# EasyEDA Pro project PCB文件.epro

# Schematic Schematic1
Board Name: Board1; Create Date: 2025-10-16; Page Name: P1; Project Name: 云端一体环境监测系统; Schematic Name: Schematic1; Update Date: 2025-11-07; Company: 嘉立创EDA; Page Size: A4; Version: V1.0
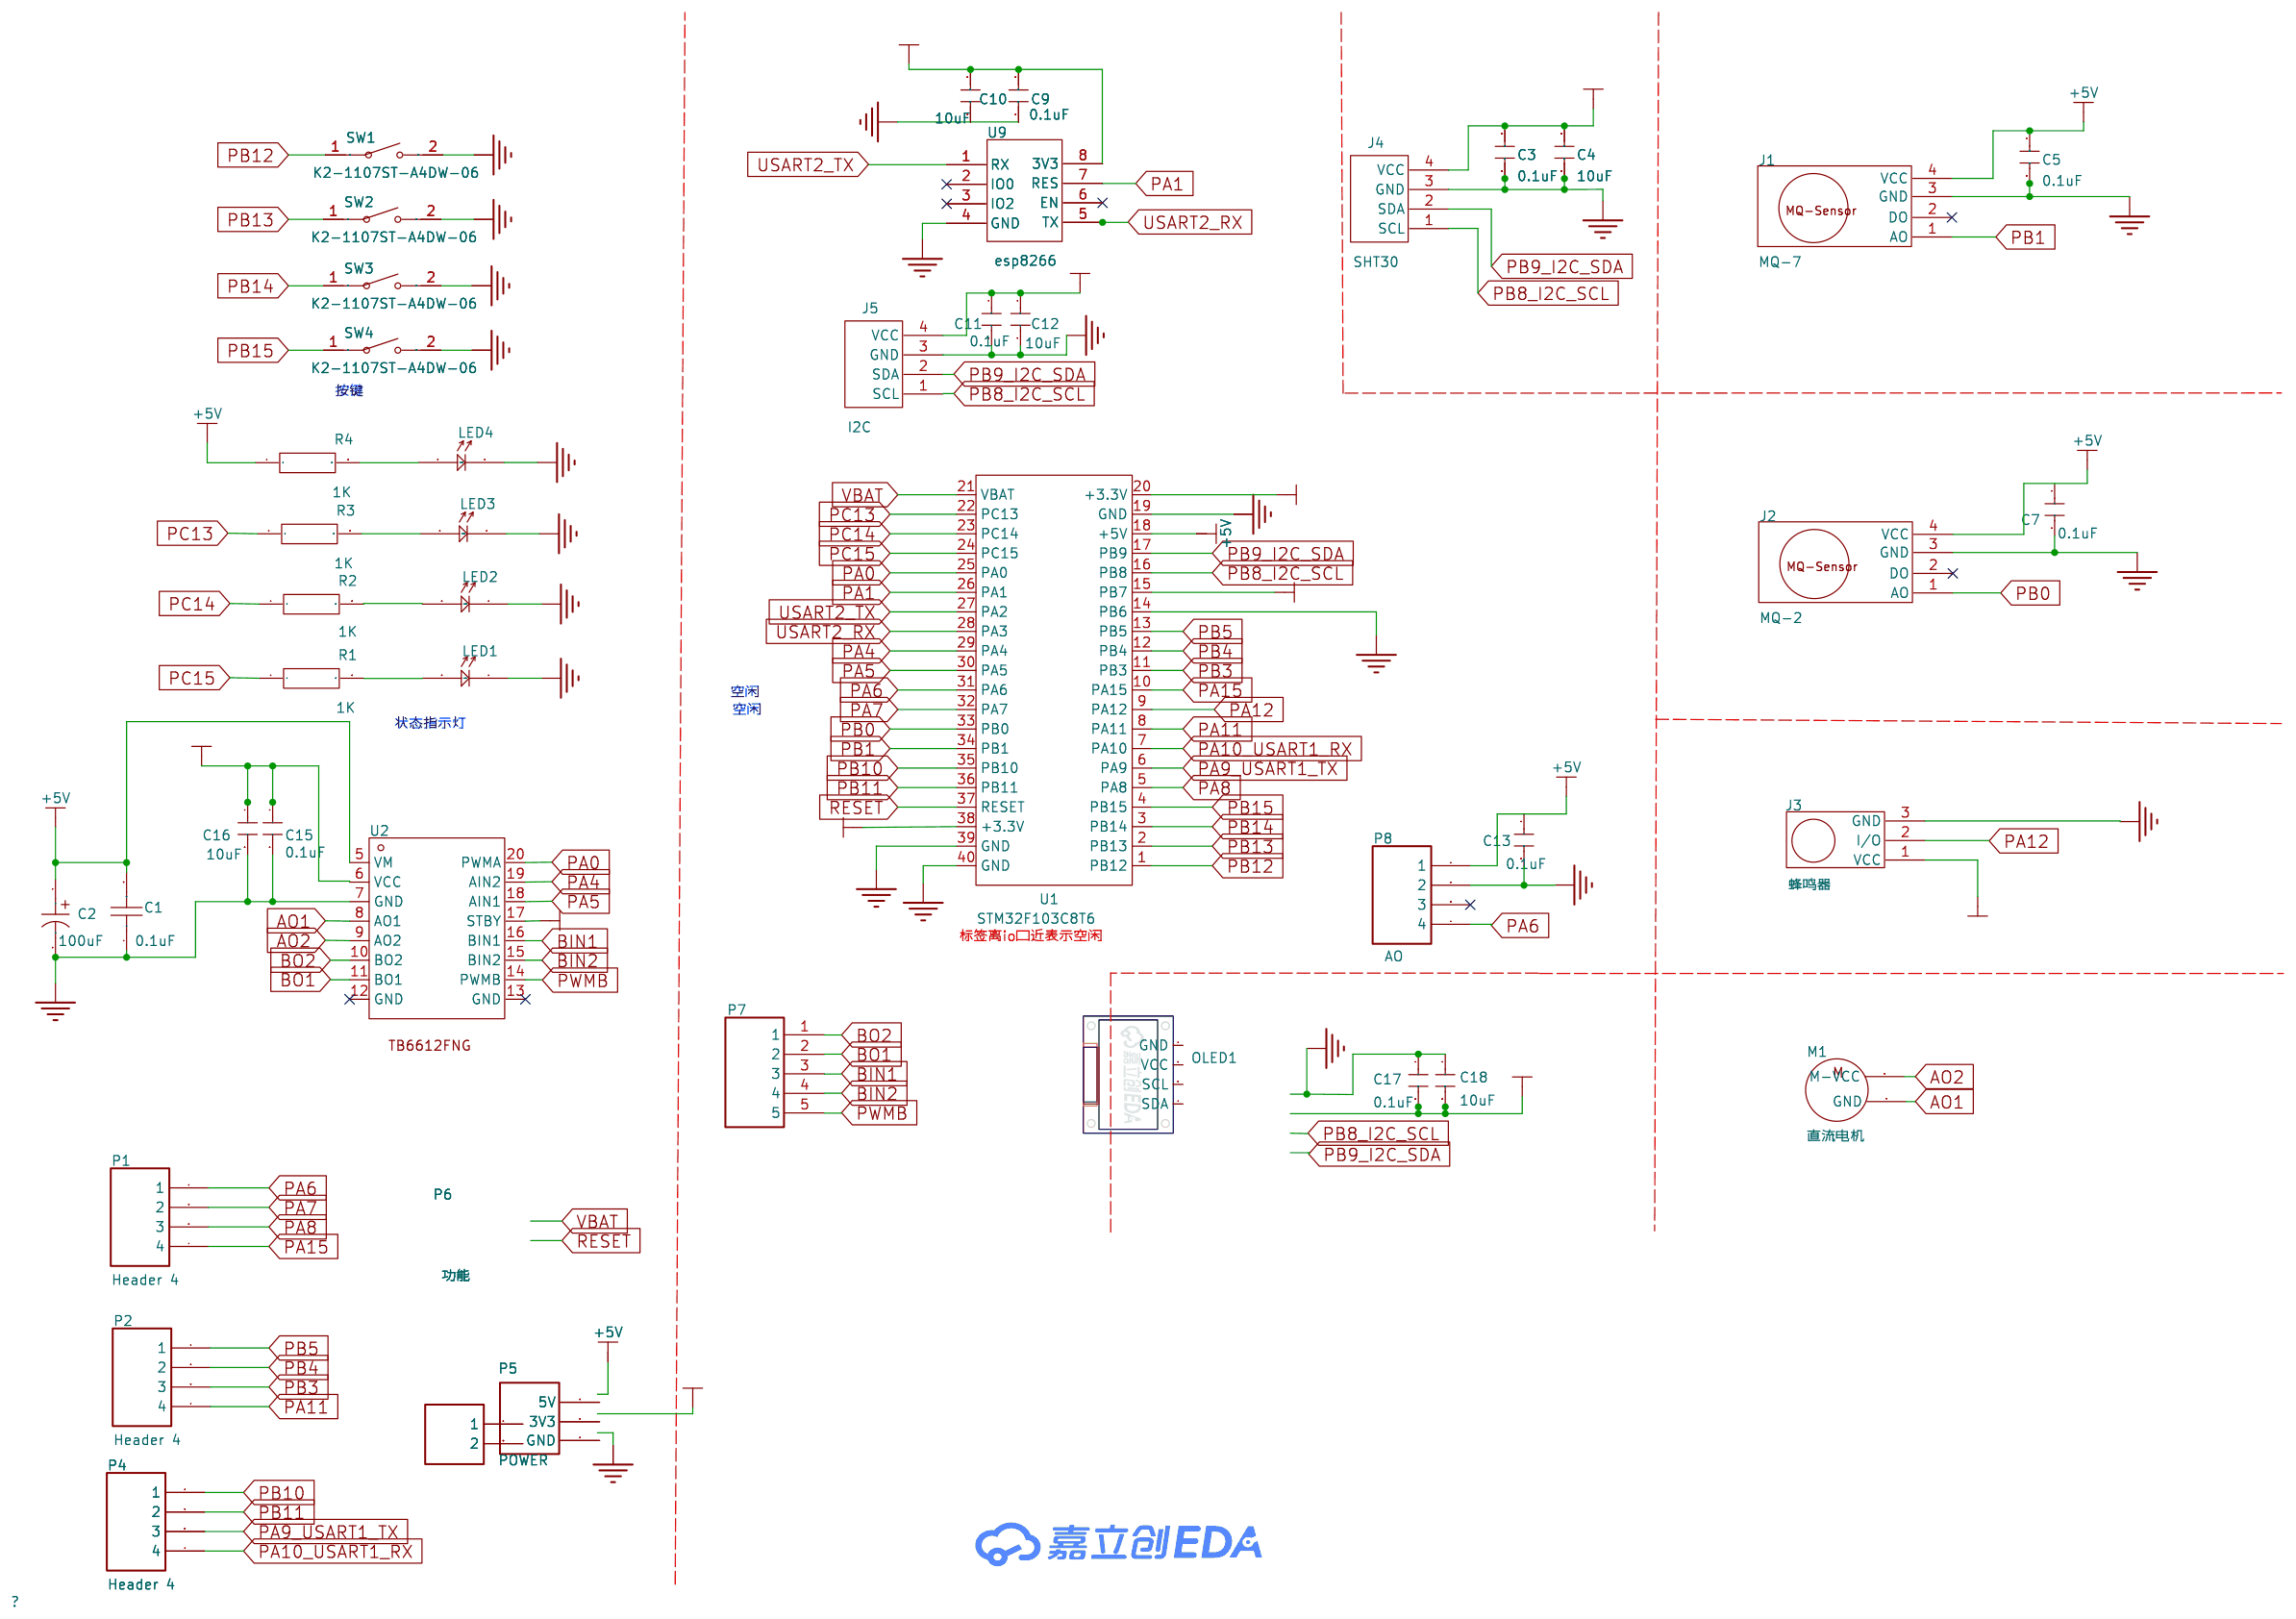
[diagram p0: schematic sheet]

## Parts
C1  100nF  [C0603]
C2  220uF  [CAP-SMD_BD6.3-L6.6-W6.6-LS7.3-FD-H7.7]
C3  0.1uF  [C0603]
C4  10uF  [C0603]
C5  0.1uF  [C0603]
C7  0.1uF  [C0603]
C9  0.1uF  [C0603]
C10  10uF  [C0603]
C11  0.1uF  [C0603]
C12  10uF  [C0603]
C13  0.1uF  [C0603]
C15  0.1uF  [C0603]
C16  10uF  [C0603]
C17  0.1uF  [C0603]
C18  10uF  [C0603]
J1  MQ-7  [4pin排母]
J2  MQ-2  [4pin排母]
J3  蜂鸣器  [3pin排母]
J4  SHT30  [4pin排母]
J5  I2C  [4pin排母]
LED1  -  [LED0603]
LED2  -  [LED0603]
LED3  -  [LED0603]
LED4  -  [LED0603]
M1  直流电机  [Motor_2pin]
OLED1  -  [0.96OLED_4P]
P1  Header 4  [4pin排母]
P2  Header 4  [4pin排母]
P4  Header 4  [4pin排母]
P5  POWER  [3pin排母]
P6  功能  [Header 2]
P7  -  [5pin]
P8  AO  [4pin排母]
R1  1K  [R0603]
R2  1K  [R0603]
R3  1K  [R0603]
R4  1K  [R0603]
SW1  K2-1107ST-A4DW-06  [KEY-SMD_L6.2-W3.6-LS8.0]
SW2  K2-1107ST-A4DW-06  [KEY-SMD_L6.2-W3.6-LS8.0]
SW3  K2-1107ST-A4DW-06  [KEY-SMD_L6.2-W3.6-LS8.0]
SW4  K2-1107ST-A4DW-06  [KEY-SMD_L6.2-W3.6-LS8.0]
U1  STM32F103C8T6  [stm32f103最小系统]
U2  TB6612FNG(O,C,8,EL  [TB6612FNG]
U9  esp8266  [esp8266 01s]

## Library data of the parts
C1 = CGA0603X7R104K500JT: 容值:100nF;精度:±10%;额定电压:50V;温度系数:X7R;; LCSC Part Name: 100nF ±10% 50V; Supplier Part: C6119867; Manufacturer: HRE(芯声); Supplier Footprint: 0603; JLCPCB Part Class: 扩展库; Datasheet: https://atta.szlcsc.com/upload/public/pdf/source/20250103/C44077DA9E7B3EFAE02F22B6D3D1CBC9.pdf; Supplier: LCSC; Tolerance: ±10%; Voltage Rating: 50V; Temperature Coefficient: X7R
C2 = JVJ25V220M6x8: 容值:220uF;精度:±20%;额定电压:25V;纹波电流:120mA@120Hz;; LCSC Part Name: 220uF ±20% 25V; Supplier Part: C46550404; Manufacturer: JIERR(捷而瑞); Supplier Footprint: SMD,D6.3xL7.7mm; JLCPCB Part Class: 扩展库; Datasheet: https://item.szlcsc.com/datasheet/JVJ25V220M6x8/48680098.html; Supplier: LCSC; Tolerance: ±20%; Voltage Rating: 25V; Ripple Current: 120mA@120Hz; Diameter: 6.3mm; Height - Seated (Max): 7.7mm; Lifetime: 2000hrs@105℃; Operating Temperature: -55℃~+105℃
C3-C5 C7 C9-C13 C15-C18 = C: 电容
J1 J2 = MQ-Sensor: 有害气体传感器模块
J3 = Buzzer: 蜂鸣器模块
J4 J5 = SHT3X-DIS: SHT30温湿度传感器模块
LED1-LED4 = LED
M1 = Motor
OLED1 = 0.96OLED模块_4P: Supplier Footprint: 插件
P1 P2 P4 P8 = Header 4: Header, 4-Pin; componentDisplayMode: -1; LatestRevisionDate: 17-Jul-2002; LatestRevisionNote: Re-released for DXP Platform.; Publisher: Altium Limited; Footprint Name: HDR1X4
P5 = 电源-3pin: 把电源引出来
P6 = Header 2: Header，2-Pin
P7 = Header 5: Header，5pin
R1-R4 = 电阻: 电阻（R）
SW1-SW4 = K2-1107ST-A4DW-06: 电路结构:单刀单掷;按钮形状:矩形按钮;作用力:2.5N;安装方式:立贴;开关长度:6.1mm;开关宽度:3.6mm;开关高度:2.5mm;触点电流:50mA;额定电压:12V;带灯:-;工作寿命:10万次;; LCSC Part Name: 轻触开关 3.6*6.1*2.5; Supplier Part: C118141; Manufacturer: 韩国韩荣; Supplier Footprint: SMD,6.1x3.6mm; JLCPCB Part Class: 扩展库; Datasheet: https://item.szlcsc.com/datasheet/K2-1107ST-A4DW-06/119400.html; Supplier: LCSC; Circuit: 单刀单掷; Actuator Style: 矩形按钮; Operating Force: 2.5N; Mounting Type: 立贴; Length: 6.1mm; Width: 3.6mm; Switch Height: 2.5mm; Contact Current: 50mA; Voltage Rating: 12V; Life: 10万次; Operating Temperature: -25℃~+85℃
U1 = LCKFB-DKX-STM32F103C8T6: LCSC Part Name: 立创·地阔星-STM32F103C8T6开发板; Supplier Part: C22396880; Manufacturer: 立创开发板; JLCPCB Part Class: 扩展库; Datasheet: https://item.szlcsc.com/datasheet/LCKFB-DKX-STM32F103C8T6/24005615.html; Supplier: LCSC
U2 = TB6612FNG(O,C,8,EL: 双直流电机驱动器集成电路; Supplier Part: C88224; Manufacturer: TOSHIBA(东芝); Supplier Footprint: SSOP-24-208mil; JLCPCB Part Class: 扩展库; Datasheet: https://item.szlcsc.com/datasheet/TB6612FNG(O%252CC%252C8%252CEL/89402.html; Supplier: LCSC; RDS(on): 500mΩ; Peak Current: 3.2A; Operating Temperature: -20℃~+85℃
U9 = ESP8266 01S: WIFI模块

## Nets
3V3: C3.1 C4.1 C9.2 C10.2 C11.1 C12.1 C15.1 C16.1 C17.2 C18.2 J3.1(VCC) J4.4(VCC) J5.4(VCC) U1.15(PB7) U1.20(+3.3V) U1.38(+3.3V) U2.6(VCC) U2.17(STBY) U9.8(3V3)
+5V: C1.2 C2.1 C5.1 C7.1 C13.1 J1.4(VCC) J2.4(VCC) P8.1 R4.1 U1.18(+5V) U2.5(VM)
GND: C1.1 C2.2 C3.2 C4.2 C5.2 C7.2 C9.1 C10.1 C11.2 C12.2 C13.2 C15.2 C16.2 C17.1 C18.1 J1.3(GND) J2.3(GND) J3.3(GND) J4.3(GND) J5.3(GND) LED1.1 LED2.1 LED3.1 LED4.1 P8.2 SW1.2 SW2.2 SW3.2 SW4.2 U1.14(PB6) U1.19(GND) U1.39(GND) U1.40(GND) U2.7(GND) U9.4(GND)
VBAT: U1.21(VBAT)
AO1: M1.1(GND) U2.8(AO1)
AO2: M1.2(M-VCC) U2.9(AO2)
BIN1: P7.3 U2.16(BIN1)
BIN2: U2.15(BIN2)
BO1: U2.11(BO1)
BO2: P7.1 U2.10(BO2)
PA0: U1.25(PA0) U2.20(PWMA)
PA1: U1.26(PA1)
PA4: U1.29(PA4) U2.19(AIN2)
PA5: U1.30(PA5) U2.18(AIN1)
PA6: P1.1 P8.4 U1.31(PA6)
PA7: P1.2 U1.32(PA7)
PA8: P1.3 U1.5(PA8)
PA9_USART1_TX: P4.3 U1.6(PA9)
PA10_USART1_RX: P4.4 U1.7(PA10)
PA11: P2.4 U1.8(PA11)
PA12: J3.2(I/O) U1.9(PA12)
PA15: P1.4 U1.10(PA15)
PB0: J2.1(AO) U1.33(PB0)
PB1: J1.1(AO) U1.34(PB1)
PB3: P2.3 U1.11(PB3)
PB4: P2.2 U1.12(PB4)
PB5: P2.1 U1.13(PB5)
PB8_I2C_SCL: U1.16(PB8)
PB9_I2C_SDA: J4.2(SDA) J5.2(SDA) U1.17(PB9)
PB10: P4.1 U1.35(PB10)
PB11: P4.2 U1.36(PB11)
PB12: SW1.1 U1.1(PB12)
PB13: SW2.1 U1.2(PB13)
PB14: SW3.1 U1.3(PB14)
PB15: SW4.1 U1.4(PB15)
PC13: R3.1 U1.22(PC13)
PC14: R2.1 U1.23(PC14)
PC15: R1.1 U1.24(PC15)
PWMB: P7.5 U2.14(PWMB)
RESET: U1.37(RESET)
USART2_RX: U1.28(PA3) U9.5(TX)
USART2_TX: U1.27(PA2) U9.1(RX)

Not connected (* = marked no-connect by the designer): J1 2(DO)*; J2 2(DO)*; J4 1(SCL); J5 1(SCL); LED1 2; LED2 2; LED3 2; LED4 2; OLED1 1(GND) 2(VCC) 3(SCL) 4(SDA); P5 1(5V) 2(3V3) 3(GND); P6 1 2; P7 2 4; P8 3*; R1 2; R2 2; R3 2; R4 2; U2 12(GND)* 13(GND)*; U9 2(IO0)* 3(IO2)* 6(EN)* 7(RES)

## Notes on the sheet
- 按键
- 空闲
- 状态指示灯
- 空闲
- 标签离io口近表示空闲

# Board PCB1
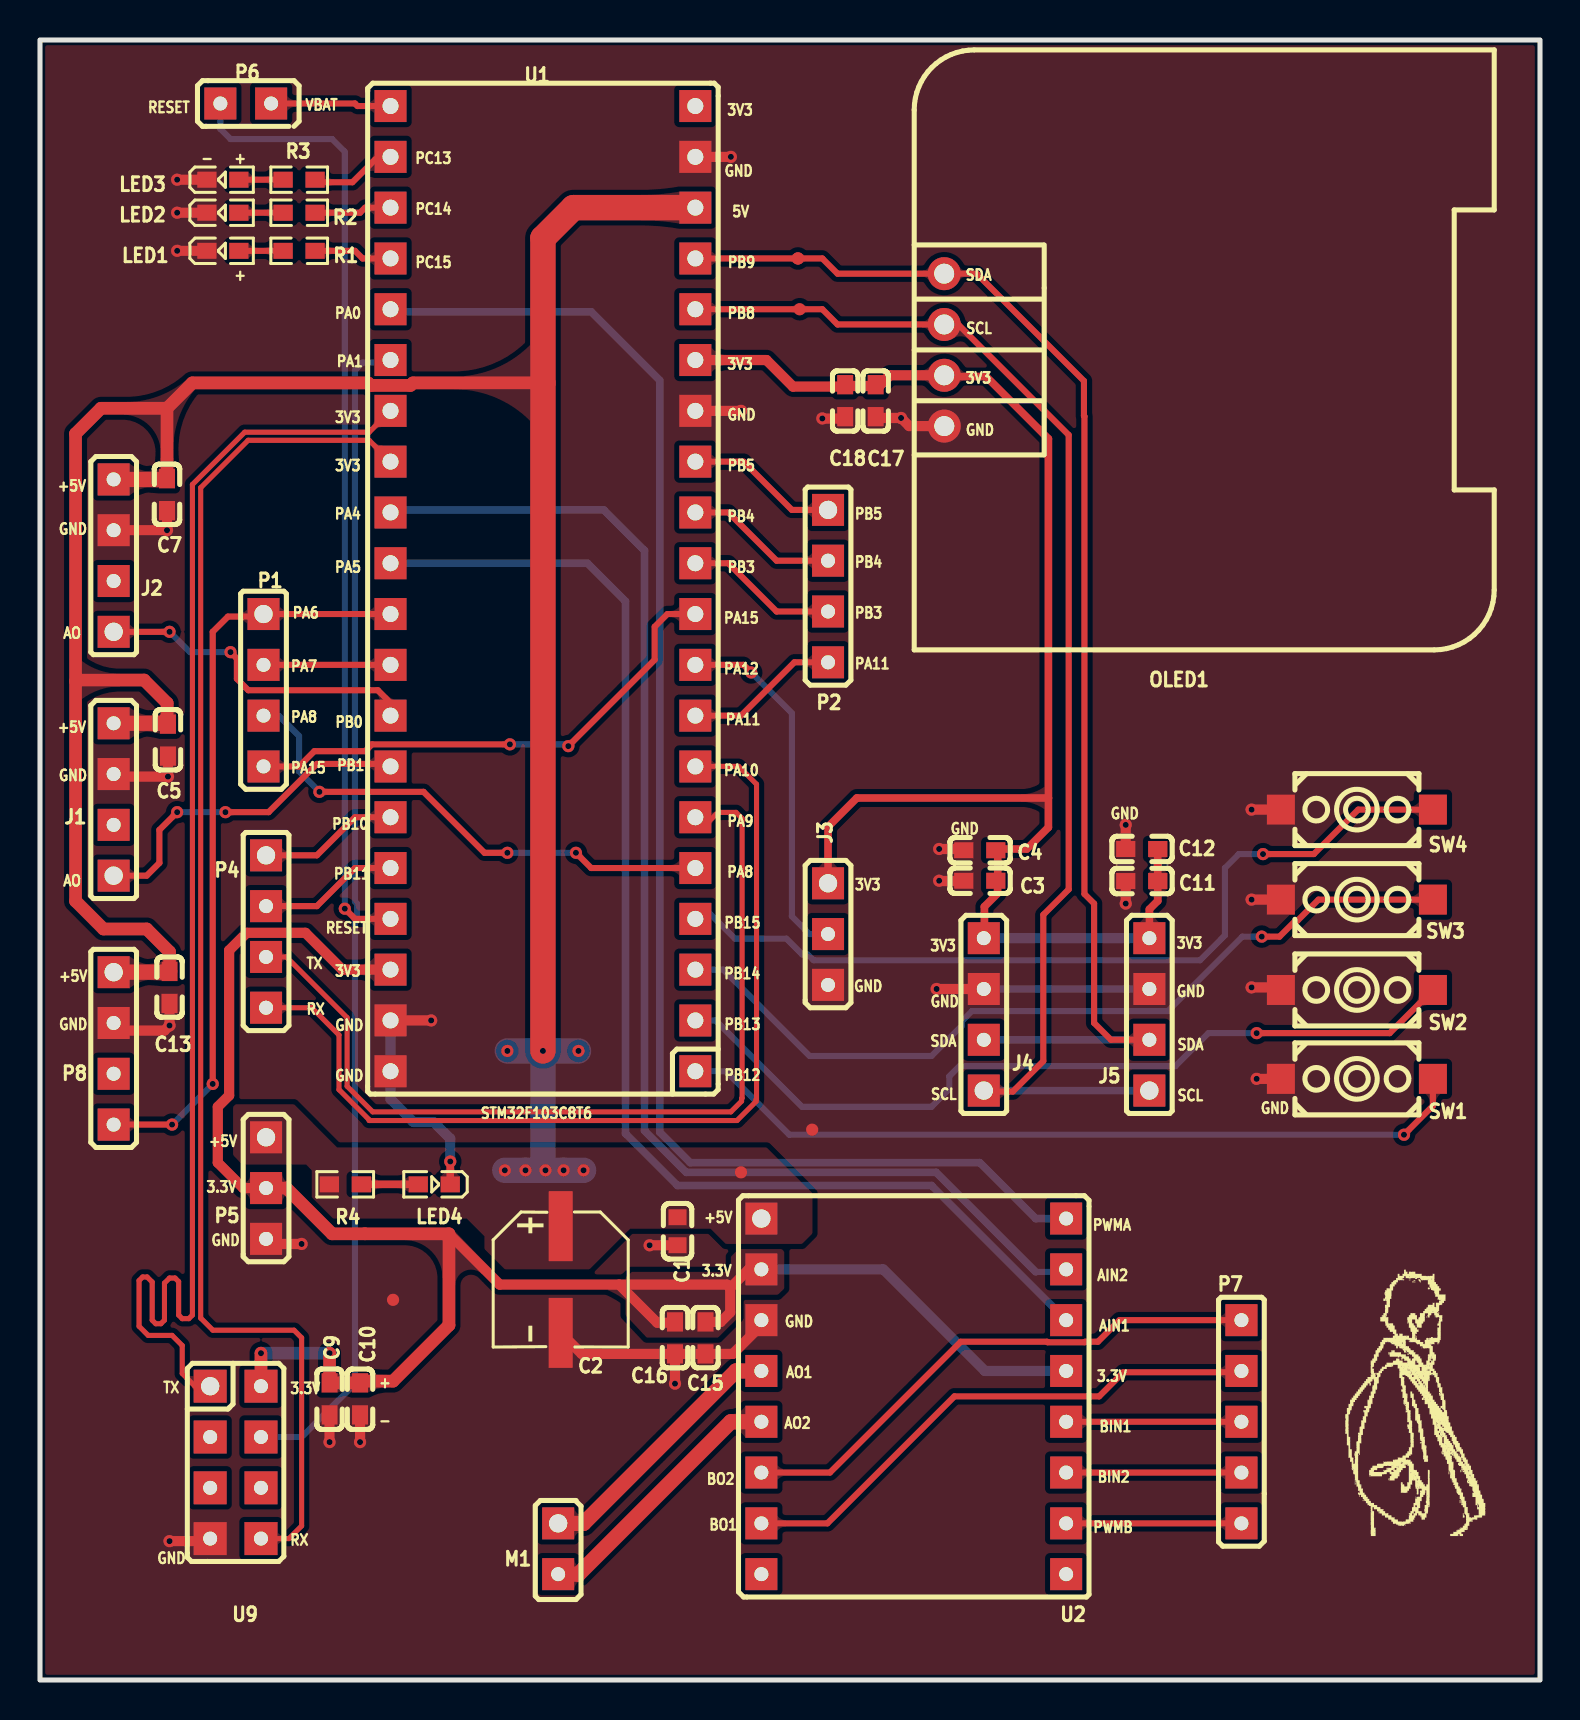
[diagram p1: board, top side]
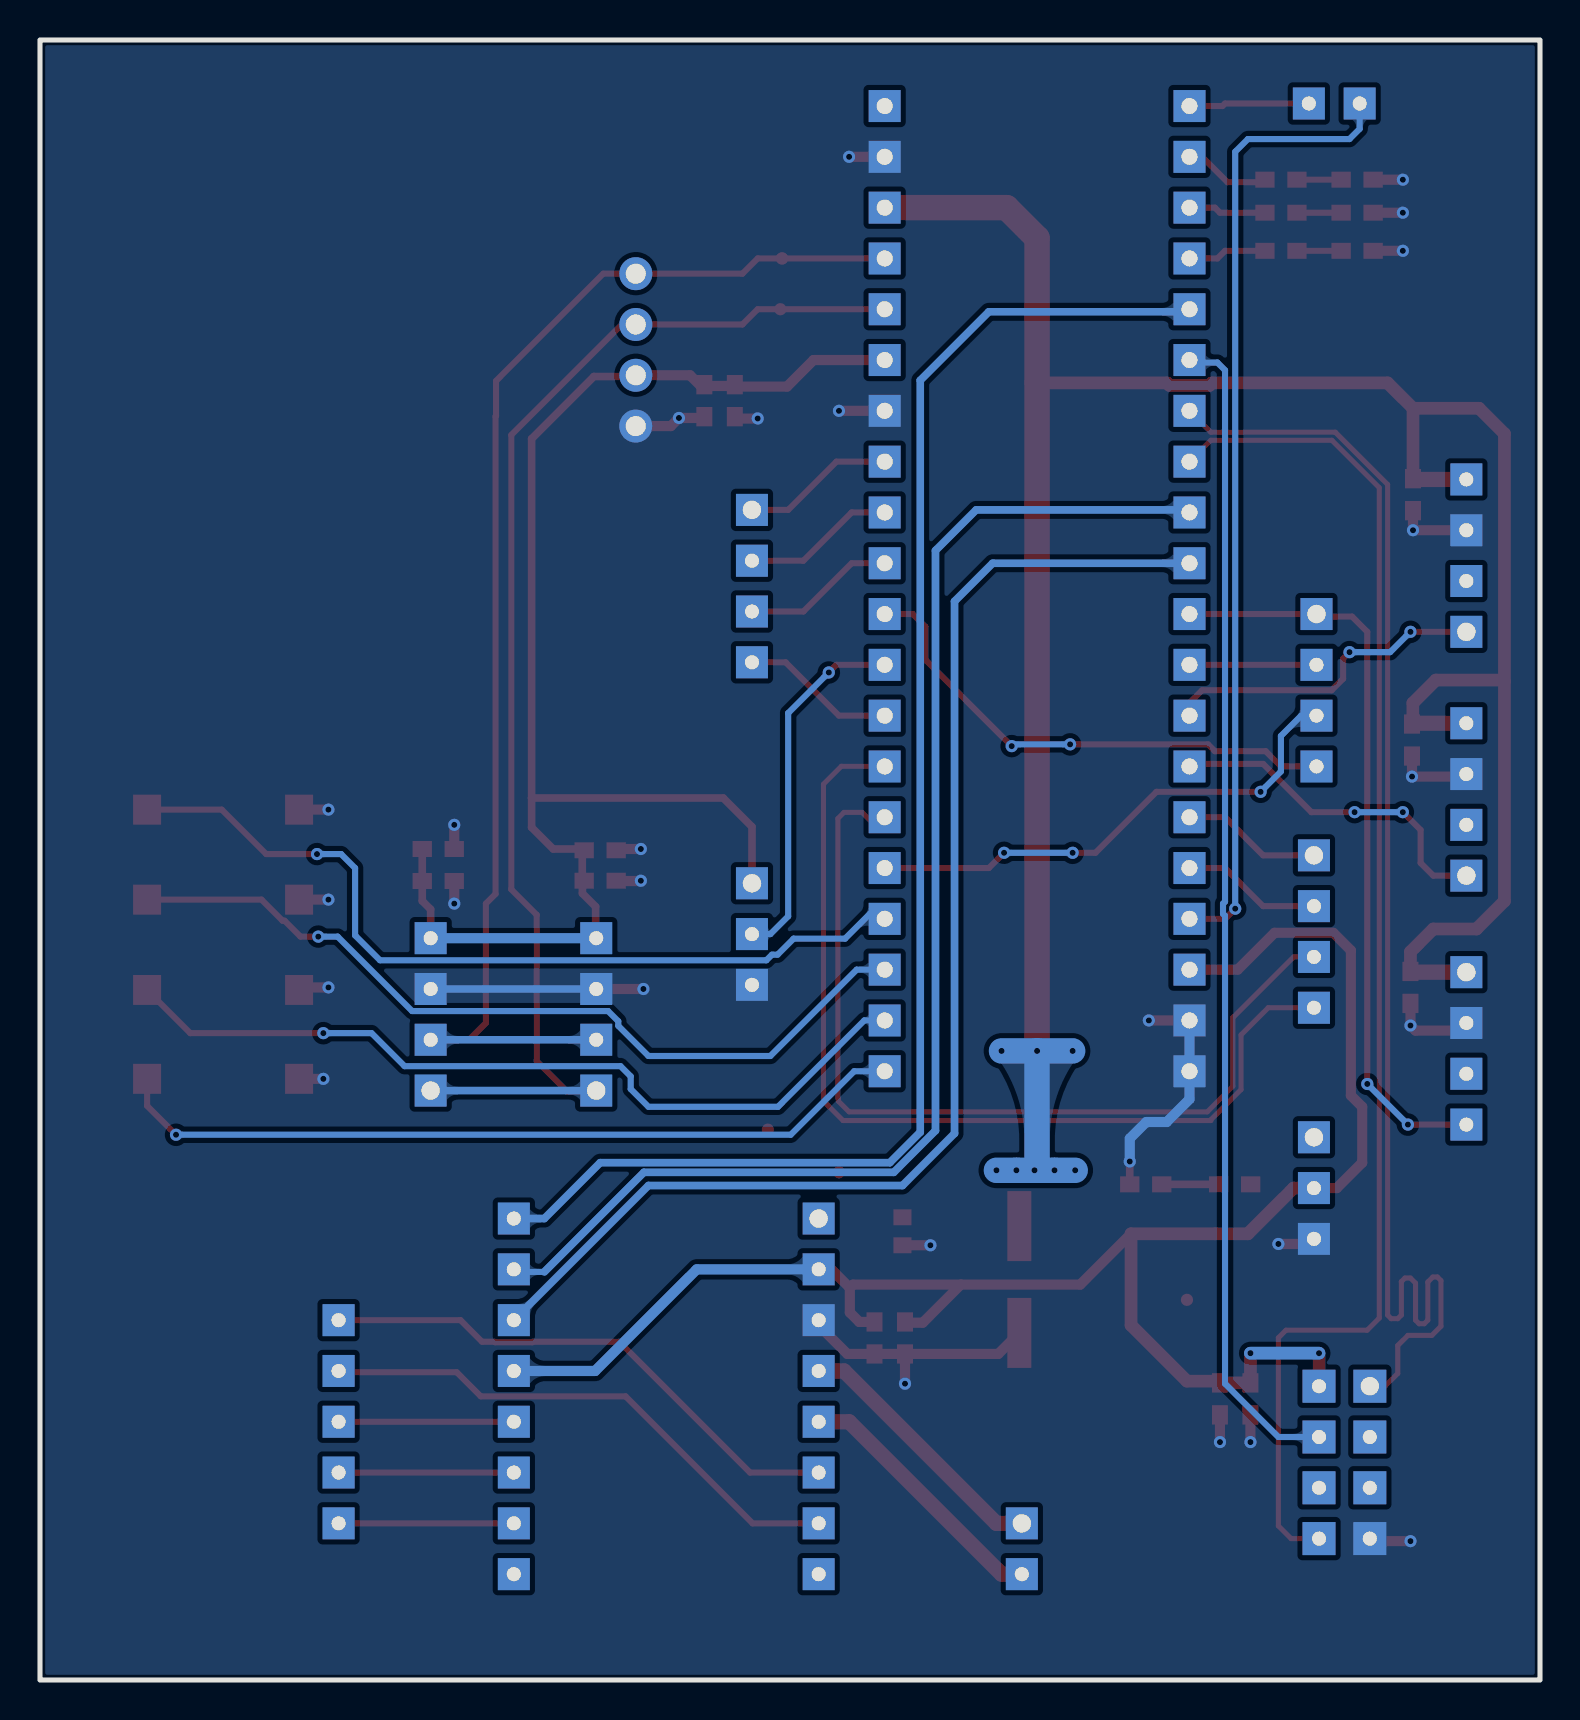
[diagram p2: board, bottom side, seen from below]

Outline 75 x 82 mm; copper layers: Top Layer, Bottom Layer. Coordinates in mm from the lower left corner of the outline.
Outline path: rectangle 0,82 75,0
Stack: Top Layer 0.035mm / Dielectric1 1.51mm FR4 er 4.5 / Bottom Layer 0.035mm

## Design rules (mm)
net USART2_TX: 串口2
net USART2_RX: 串口2
net PA10_USART1_RX: 串口
net PA9_USART1_TX: 串口
template: 自定义配置
spacing copperThickness1oz (default): track to track 0.102, other pairs 0.152 to 0.3
spacing copperThickness2oz: track to track 0.203, other pairs 0.152 to 0.3
track width copperThickness1oz (default): min 0.127, default 0.305, max 2.54
track width copperThickness2oz: min 0.203, default 0.254, max 2.54
differential pair differentialPair (default): width min 0.127, default 0.254, max 2.54; gap min 0.152, default 0.152
via viaSize (default): diameter min 0.5, default 0.61, max 10; hole min 0.3, default 0.305, max 6.3

## Placement (name value [footprint] x y rotation side)
C1  100nF  [C0603#2]  31.88 22.44 90 top
C2  220uF  [CAP-SMD_BD6.3-L6.6-W6.6-LS7.3-FD-H7.7]  26.03 20.02 270 top
C3  0.1uF  [C0603]  46.99 39.96 180 top
C4  10uF  [C0603]  46.99 41.49 180 top
C5  0.1uF  [C0603]  6.4 47 270 top
C7  0.1uF  [C0603]  6.35 59.27 270 top
C9  0.1uF  [C0603]  14.48 14.06 90 top
C10  10uF  [C0603]  16 14.06 90 top
C11  0.1uF  [C0603]  55.09 39.95 180 top
C12  10uF  [C0603]  55.09 41.55 180 top
C13  0.1uF  [C0603]  6.48 34.63 270 top
C15  0.1uF  [C0603]  33.27 17.1 270 top
C16  10uF  [C0603]  31.75 17.1 270 top
C17  0.1uF  [C0603]  41.78 63.97 90 top
C18  10uF  [C0603]  40.26 63.97 90 top
J1  MQ-7  [4pin排母]  3.68 40.22 180 top
J2  MQ-2  [4pin排母]  3.68 52.41 180 top
J3  蜂鸣器  [3pin排母]  39.4 39.84 0 top
J4  SHT30  [4pin排母]  47.19 29.47 180 top
J5  I2C  [4pin排母]  55.47 29.47 180 top
LED1  -  [LED0603]  9.14 71.46 0 top
LED2  -  [LED0603]  9.14 73.36 0 top
LED3  -  [LED0603]  9.14 75.02 0 top
LED4  -  [LED0603]  19.71 24.78 180 top
M1  直流电机  [Motor_2pin]  25.91 7.83 270 top
NOREF  -  [Pad_e1]  17.65 19.01 0 top
NOREF#2  -  [Pad_e42]  35.05 25.38 0 top
NOREF#3  -  [Pad_e40]  37.9 71.08 0 top
NOREF#4  -  [Pad_e2]  37.98 68.54 0 top
NOREF#5  -  [Pad_e33]  37.9 71.08 0 top
NOREF#6  -  [Pad_e44]  38.61 27.52 0 top
NOREF#7  -  [Pad_e5163]  16.25 22.31 0 top
OLED1  -  [0.96OLED_4P]  45.21 66.51 90 top
P1  Header 4  [4pin排母]  11.18 53.3 0 top
P2  Header 4  [4pin排母]  39.4 58.5 0 top
P4  Header 4  [4pin排母]  11.3 41.23 0 top
P5  POWER  [3pin排母]  11.3 27.14 0 top
P6  功能  [Header 2]  11.56 78.83 270 top
P7  -  [5pin]  60.07 17.99 0 top
P8  AO  [4pin排母]  3.68 35.39 0 top
R1  1K  [R0603]  12.95 71.46 180 top
R2  1K  [R0603]  12.95 73.36 180 top
R3  1K  [R0603]  12.95 75.02 180 top
R4  1K  [R0603]  15.27 24.78 0 top
SW1  K2-1107ST-A4DW-06  [KEY-SMD_L6.2-W3.6-LS8.0]  65.84 30.06 180 top
SW2  K2-1107ST-A4DW-06  [KEY-SMD_L6.2-W3.6-LS8.0]  65.84 34.5 180 top
SW3  K2-1107ST-A4DW-06  [KEY-SMD_L6.2-W3.6-LS8.0]  65.84 39.02 180 top
SW4  K2-1107ST-A4DW-06  [KEY-SMD_L6.2-W3.6-LS8.0]  65.84 43.52 180 top
U1  STM32F103C8T6  [stm32f103最小系统]  17.53 78.7 0 top
U2  TB6612FNG(O,C,8,EL  [TB6612FNG]  36.07 23.07 0 top
U9  esp8266  [esp8266 01s]  8.51 14.69 0 top

## Footprints (pads in the part's own frame, mm; a bottom-side part is the same pattern mirrored in y, then rotated)
0.96OLED_4P
  round 1.65 hole 1: 1(-3.81,-0.002) 2(-1.27,0.002) 3(1.27,0.002) 4(3.81,0.002)
3pin排母
  rect 1.6x1.6 hole 0.7x0.914: 1(0,0)
  rect 1.6x1.6 hole 0.7: 2(0,-2.54) 3(0,-5.08)
4pin排母
  rect 1.6x1.6 hole 0.7x0.914: 1(0,0)
  rect 1.6x1.6 hole 0.7: 2(0,-2.54) 3(0,-5.08) 4(0,-7.62)
5pin
  rect 1.6x1.6 hole 0.7: 1(0,0) 2(0,-2.54) 3(0,-5.08) 4(0,-7.62) 5(0,-10.16)
C0603
  rect 0.965x0.8 smd: 1(-0.8,0) 2(0.8,0)
C0603#2
  rect 0.8x0.9 smd: 1(-0.7,0) 2(0.7,0)
CAP-SMD_BD6.3-L6.6-W6.6-LS7.3-FD-H7.7
  rect 3.5x1.2 smd: 1(-2.67,0) 2(2.67,0)
esp8266 01s
  rect 1.65x1.65 hole 0.914x0.7: 1(0,0)
  rect 1.65x1.65 hole 0.7: 2(0,-2.54) 3(0,-5.08) 4(0,-7.62) 5(2.54,-7.62) 6(2.54,-5.08) 7(2.54,-2.54) 8(2.54,0)
Header 2
  rect 1.6x1.6 hole 0.7: 1(0,0) 2(0,-2.54)
KEY-SMD_L6.2-W3.6-LS8.0
  rect 1.4x1.5 smd: 1(-3.8,0) 2(3.8,0)
LED0603
  rect 0.965x0.8 smd: 1(-0.8,0) 2(0.8,0)
Motor_2pin
  rect 1.6x1.6 hole 0.914x0.7: 1(0,0)
  rect 1.6x1.6 hole 0.7: 2(2.54,0)
Pad_e1
  round 0.61 smd: TP1(0,0)
Pad_e2
  round 0.61 smd: TP2(0,0)
Pad_e33
  round 0.61 smd: TP3(0,0)
Pad_e40
  round 0.61 smd: TP4(0,0)
Pad_e42
  round 0.61 smd: TP5(0,0)
Pad_e44
  round 0.61 smd: TP6(0,0)
Pad_e5163
  round 0.61 smd: TP2(0,0)
R0603
  rect 0.965x0.8 smd: 1(-0.8,0) 2(0.8,0)
stm32f103最小系统
  rect 1.6x1.6 hole 0.8: 1(15.24,-48.26) 2(15.24,-45.72) 3(15.24,-43.18) 4(15.24,-40.64) 5(15.24,-38.1) 6(15.24,-35.56) 7(15.24,-33.02) 8(15.24,-30.48) 9(15.24,-27.94) 10(15.24,-25.4) 11(15.24,-22.86) 12(15.24,-20.32) 13(15.24,-17.78) 14(15.24,-15.24) 15(15.24,-12.7) 16(15.24,-10.16) 17(15.24,-7.62) 18(15.24,-5.08) 19(15.24,-2.54) 20(15.24,0) 21(0,0) 22(0,-2.54) 23(0,-5.08) 24(0,-7.62) 25(0,-10.16) 26(0,-12.7) 27(0,-15.24) 28(0,-17.78) 29(0,-20.32) 30(0,-22.86) 31(0,-25.4) 32(0,-27.94) 33(0,-30.48) 34(0,-33.02) 35(0,-35.56) 36(0,-38.1) 37(0,-40.64) 38(0,-43.18) 39(0,-45.72) 40(0,-48.26)
TB6612FNG
  rect 1.6x1.6 hole 0.914x0.7: 1(0,0)
  rect 1.6x1.6 hole 0.7: 2(0,-2.54) 3(0,-5.08) 4(0,-7.62) 5(0,-10.16) 6(0,-12.7) 7(0,-15.24) 8(0,-17.78) 9(15.24,-17.78) 10(15.24,-15.24) 11(15.24,-12.7) 12(15.24,-10.16) 13(15.24,-7.62) 14(15.24,-5.08) 15(15.24,-2.54) 16(15.24,0)

## Nets
3V3: C3.1 C4.1 C9.2 C10.2 C11.1 C12.1 C15.1 C16.1 C17.2 C18.2 J3.1 J4.4 J5.4 NOREF#7.TP2 OLED1.2 P5.2 U1.15 U1.20 U1.38 U2.2 U2.13 U9.8
+5V: C1.2 C2.1 C5.1 C7.1 C13.1 J1.4 J2.4 NOREF#2.TP5 P5.1 P8.1 R4.1 U1.18 U2.1
GND: C1.1 C2.2 C3.2 C4.2 C5.2 C7.2 C9.1 C10.1 C11.2 C12.2 C13.2 C15.2 C16.2 C17.1 C18.1 J1.3 J2.3 J3.3 J4.3 J5.3 LED1.1 LED2.1 LED3.1 LED4.1 NOREF.TP1 NOREF#6.TP6 OLED1.1 P5.3 P8.2 SW1.2 SW2.2 SW3.2 SW4.2 U1.14 U1.19 U1.39 U1.40 U2.3 U9.4
VBAT: P6.1 U1.21
AO1: M1.1 U2.4
AO2: M1.2 U2.5
BIN1: P7.3 U2.12
BIN2: P7.4 U2.11
BO1: P7.2 U2.7
BO2: P7.1 U2.6
PA0: U1.25 U2.16
PA1: U1.26 U9.7
PA4: U1.29 U2.15
PA5: U1.30 U2.14
PA6: P1.1 P8.4 U1.31
PA7: P1.2 U1.32
PA8: P1.3 U1.5
PA9_USART1_TX: P4.3 U1.6
PA10_USART1_RX: P4.4 U1.7
PA11: P2.4 U1.8
PA12: J3.2 U1.9
PA15: P1.4 U1.10
PB0: J2.1 U1.33
PB1: J1.1 U1.34
PB3: P2.3 U1.11
PB4: P2.2 U1.12
PB5: P2.1 U1.13
PB8_I2C_SCL: J4.1 J5.1 NOREF#4.TP2 OLED1.3 U1.16
PB9_I2C_SDA: J4.2 J5.2 NOREF#3.TP4 NOREF#5.TP3 OLED1.4 U1.17
PB10: P4.1 U1.35
PB11: P4.2 U1.36
PB12: SW1.1 U1.1
PB13: SW2.1 U1.2
PB14: SW3.1 U1.3
PB15: SW4.1 U1.4
PC13: R3.1 U1.22
PC14: R2.1 U1.23
PC15: R1.1 U1.24
PWMB: P7.5 U2.10
RESET: P6.2 U1.37
USART2_RX: U1.28 U9.5
USART2_TX: U1.27 U9.1
$1N12480: LED1.2 R1.2
$1N12483: LED2.2 R2.2
$1N12485: LED3.2 R3.2
$1N20799: LED4.2 R4.2

Pads without a net: J1 2; J2 2; P8 3; U2 8 9; U9 2 3 6

## Via types
v1: diameter 0.61, hole 0.305, Top Layer to Bottom Layer, 54 vias

## Routing (per net, layer and track width the routed paths; a pad name or vN(x,y) marks a point on that pad's centre or on a via; arc(x,y) is an arc through that point)
3V3: length 166.4
  Top Layer w0.381: 47.88,39.96 47.88,39.33 47.22,38.67 47.22,37.12 J4.4 ; C12.1 C11.1 55.89,38.95 55.47,38.54 J5.4 ; 50.42,44.1 40.84,44.1 39.4,42.66 J3.1 ; 50.42,44.1 50.42,42.63 49.34,41.55 47.89,41.55 47.89,39.97 ; 50.42,44.1 50.42,62.06 47.31,65.17 45.27,65.17 OLED1.2
  Top Layer w0.508: 28.96,19.77 22.99,19.77 20.45,22.31 ; 28.96,19.77 30.86,17.86 31.71,17.86 31.75,17.9 ; 28.96,19.77 34.35,19.77 34.51,19.61 ; 34.51,19.61 34.51,18.38 34.04,17.9 33.27,17.9 ; 34.51,19.61 35.43,20.53 U2.2 ; U1.15 36.32,66 37.65,64.67 40.26,64.67 40.29,64.7 41.96,64.7 42.5,65.24 OLED1.2 ; U1.38 15.11,35.52 13.27,37.36 10.33,37.36 9.46,36.48 9.46,29.23 8.89,28.66 8.89,25.87 10.16,24.6 P5.2
  Top Layer w0.635: P5.2 12.32,24.6 14.61,22.31 NOREF#7.TP2 20.45,22.31 20.45,17.74 17.65,14.94 16.09,14.94 C10.2 C9.2 v1(14.48,16.34) ; U9.8 v1(11.05,16.34)
  Bottom Layer w0.508: U2.2 42.16,20.53 47.24,15.45 U2.13 ; J4.4 J5.4
  Bottom Layer w0.635: v1(11.05,16.34) v1(14.48,16.34)
+5V: length 134.9
  Top Layer w0.635: 6.35,63.58 7.62,64.86 16.41,64.86 16.53,64.73 18.52,64.73 18.65,64.86 25.15,64.86 ; 6.35,63.58 C7.1 ; 6.35,63.58 3.05,63.58 1.78,62.31 1.78,49.94 ; 6.36,47.84 6.36,48.85 5.21,50 1.83,50 1.78,49.94 ; 1.78,49.94 1.78,38.95 3.17,37.55 5.33,37.55 6.48,36.41 C13.1
  Top Layer w0.762: P8.1 6.44,35.39 C13.1 ; J1.4 6.36,47.84 C5.1 ; 3.68,60.03 6.31,60.03 C7.1
  Top Layer w1.27: v1(25.15,31.45) 25.15,72.09 26.67,73.62 U1.18
  Bottom Layer w1.27: v1(27.18,25.48) v1(26.18,25.48) v1(25.27,25.48) ; v1(25.15,31.45) v1(23.37,31.45) ; v1(25.15,31.45) v1(26.92,31.45) ; v1(25.15,31.45) 25.15,25.61 v1(25.27,25.48) ; v1(25.27,25.48) v1(24.27,25.48) v1(23.24,25.48)
GND: length 78.9
  Top Layer w0.381: LED4.1 v1(20.51,25.93)
  Top Layer w0.508: C16.2 v1(31.75,14.82) ; C16.2 27.09,16.3 C2.2 ; C16.2 C15.2 34.63,16.3 36.07,17.74 U2.3 ; v1(44.96,39.96) 44.97,39.95 46.26,39.95 ; 62.05,39.02 v1(60.58,39.02) ; LED3.1 v1(6.86,75.02) ; LED2.1 v1(6.86,73.36) ; 62.05,34.5 61.92,34.63 v1(60.58,34.63) ; 6.48,33.83 v1(6.48,32.72) 6.22,32.47 4.06,32.47 P8.2 ; C9.1 v1(14.48,11.9) ; v1(39.12,63.08) 39.12,63.07 40.26,63.07 ; LED1.1 v1(6.86,71.46) ; C11.2 v1(54.29,38.82) ; C7.2 v1(6.35,57.49) J2.3 ; U9.4 8.38,6.94 v1(6.48,6.94) ; U1.39 v1(19.56,32.98) ; C12.2 v1(54.29,42.76) ; U1.19 v1(34.54,76.16) ; C10.1 v1(16,11.9) ; OLED1.1 43.46,62.7 v1(43.05,63.1) 41.96,63.1 ; 62.05,43.52 v1(60.58,43.52) ; J4.3 v1(44.83,34.55) ; J1.3 3.81,45.17 v1(6.4,45.17) C5.2 ; P5.3 11.56,21.8 v1(13.08,21.8) ; U1.14 v1(35.05,63.46) ; 62.05,30.06 v1(60.83,30.06) ; 46.29,41.55 v1(44.96,41.55) ; C1.1 v1(30.48,21.74)
  Bottom Layer w0.381: J4.3 J5.3
  Bottom Layer w0.508: v1(20.51,25.93) 20.51,27.07 19.69,27.9 18.67,27.9 17.53,29.04 U1.40 U1.39
VBAT: length 6
  Top Layer w0.305: U1.21 15.88,78.7 15.75,78.83 P6.1
AO1: length 12.9
  Top Layer w0.762: 26.29,7.83 27.18,7.83 34.8,15.45 U2.4
AO2: length 13.3
  Top Layer w0.762: U2.5 34.54,12.91 26.92,5.29 M1.2
BIN1: length 8.8
  Top Layer w0.305: U2.12 P7.3
BIN2: length 8.8
  Top Layer w0.305: U2.11 P7.4
BO1: length 27.2
  Top Layer w0.305: U2.7 39.37,7.83 45.72,14.18 52.96,14.18 54.17,15.39 60.01,15.39 P7.2
BO2: length 27.2
  Top Layer w0.305: P7.1 53.97,17.99 52.9,16.91 52.26,16.91 52.23,16.89 50.38,16.89 50.36,16.91 46.04,16.91 39.5,10.37 U2.6
PA0: length 74.6
  Bottom Layer w0.381: U2.16 49.78,23.07 46.99,25.87 32.51,25.87 30.99,27.39 30.99,64.98 27.56,68.41 17.53,68.41
PA1: length 58.5
  Bottom Layer w0.305: U1.26 17.4,65.87 16.13,65.87 15.75,65.49 15.75,38.92 15.85,38.82 15.85,38.31 15.75,38.21 15.75,14.82 13.08,12.15 U9.7
PA4: length 66.7
  Bottom Layer w0.305: U2.15 51.18,20.41 49.78,20.41
  Bottom Layer w0.381: U1.29 17.65,58.5 28.19,58.5 30.23,56.47 30.23,27.47 32.31,25.38 44.81,25.38 49.78,20.41
PA5: length 65
  Bottom Layer w0.381: U2.14 44.58,24.72 31.88,24.72 29.27,27.33 29.27,53.93 27.37,55.84 U1.30
PA6: length 37.7
  Top Layer w0.305: v1(8.64,29.8) 8.64,52.41 9.4,53.17 11.05,53.17 P1.1 U1.31 ; v1(6.6,27.77) P8.4
  Bottom Layer w0.305: v1(8.64,29.8) v1(6.6,27.77)
PA7: length 6.3
  Top Layer w0.305: P1.2 U1.32
PA8: length 25.8
  Top Layer w0.305: U1.5 27.56,40.6 v1(26.8,41.36) ; v1(23.37,41.36) 22.22,41.36 19.18,44.41 v1(13.97,44.41)
  Bottom Layer w0.305: v1(13.97,44.41) 12.95,45.42 12.95,47.2 11.94,48.22 P1.3 ; v1(26.8,41.36) v1(23.37,41.36)
PA9_USART1_TX: length 46.1
  Top Layer w0.254: U1.6 33.03,42.87 33.39,42.87 33.9,43.38 34.8,43.38 35.1,43.08 35.1,29.09 35.08,29.07 35.08,28.94 34.54,28.41 16.64,28.41 15.36,29.69 15.36,33.12 12.32,36.15 P4.3
PA10_USART1_RX: length 48.2
  Top Layer w0.254: U1.7 32.77,45.68 34.93,45.68 35.83,44.79 35.83,29.04 35.8,29.02 35.8,28.93 34.85,27.97 16.46,27.97 16.46,28.01 14.95,29.52 14.95,32.25 13.59,33.61 P4.4
PA11: length 7.7
  Top Layer w0.305: P2.4 37.72,50.89 35.05,48.22 U1.8
PA12: length 18.2
  Top Layer w0.305: U1.9 35.18,50.76 v1(35.56,50.38)
  Bottom Layer w0.305: J3.2 38.48,37.3 37.59,38.19 37.59,48.34 v1(35.56,50.38)
PA15: length 25.8
  Top Layer w0.305: P1.4 12.95,45.68 13.72,46.44 16.26,46.44 16.6,46.78 v1(23.5,46.78) ; v1(26.42,46.69) 30.73,51.01 30.73,52.66 31.37,53.3 U1.10
  Bottom Layer w0.305: v1(23.5,46.78) 26.33,46.78 v1(26.42,46.69)
PB0: length 16.5
  Top Layer w0.305: v1(6.48,52.41) J2.1 ; v1(9.53,51.39) 9.84,51.07 9.84,50.06 10.42,49.49 16.89,49.49 17.53,48.85 U1.33
  Bottom Layer w0.305: v1(6.48,52.41) 7.49,51.39 v1(9.53,51.39)
PB1: length 17.2
  Top Layer w0.305: v1(9.27,43.39) 11.43,43.39 13.84,45.81 17.4,45.81 U1.34 ; v1(6.86,43.39) 5.97,42.5 5.97,40.85 5.33,40.22 J1.1
  Bottom Layer w0.305: v1(9.27,43.39) v1(6.86,43.39)
PB3: length 7.6
  Top Layer w0.305: U1.11 34.42,55.84 36.83,53.42 P2.3
PB4: length 7.6
  Top Layer w0.305: U1.12 34.42,58.38 36.83,55.97 P2.2
PB5: length 7.6
  Top Layer w0.305: P2.1 37.59,58.5 35.18,60.92 U1.13
PB8_I2C_SCL: length 65
  Top Layer w0.305: J4.1 47.24,29.42 48.64,29.42 50.16,30.95 50.16,38.26 51.44,39.53 51.44,62.25 45.91,67.78 OLED1.3 39.88,67.78 39.12,68.54 NOREF#4.TP2 U1.16
  Bottom Layer w0.381: J4.1 J5.1
PB9_I2C_SDA: length 65.7
  Top Layer w0.305: J5.2 53.54,32.01 52.71,32.85 52.71,38.82 52.22,39.3 52.22,63.18 52.2,63.21 52.2,64.95 46.83,70.32 OLED1.4 39.88,70.32 39.12,71.08 NOREF#3.TP4 U1.17
  Bottom Layer w0.381: J4.2 J5.2
PB10: length 7
  Top Layer w0.305: P4.1 13.84,41.23 15.75,43.14 U1.35
PB11: length 7
  Top Layer w0.305: P4.2 13.84,38.69 15.75,40.6 U1.36
PB12: length 40.1
  Top Layer w0.305: SW1.1 69.65,28.71 v1(68.2,27.26)
  Bottom Layer w0.305: v1(68.2,27.26) 37.47,27.26 34.29,30.44 U1.1
PB13: length 41.5
  Top Layer w0.305: v1(60.83,32.34) 67.49,32.34 SW2.1
  Bottom Layer w0.305: U1.2 33.78,32.98 38.1,28.66 44.58,28.66 45.47,29.55 45.47,30.18 45.97,30.69 56.77,30.69 58.42,32.34 v1(60.83,32.34)
PB14: length 42
  Top Layer w0.305: SW3.1 63.93,39.02 62.87,37.96 62.77,37.96 61.98,37.17 v1(61.09,37.17)
  Bottom Layer w0.305: v1(61.09,37.17) 60.12,37.17 56.39,33.45 46.59,33.45 46.09,32.94 46.09,32.71 44.58,31.2 38.48,31.2 34.16,35.52 U1.3
PB15: length 43.1
  Top Layer w0.305: SW4.1 65.91,43.52 63.69,41.3 v1(61.15,41.3)
  Bottom Layer w0.305: U1.4 33.05,38.34 33.48,38.34 34.75,37.07 37.32,37.07 38.12,36.27 38.4,36.27 38.68,35.99 58,35.99 59.25,37.23 59.25,40.6 59.94,41.3 v1(61.15,41.3)
PC13: length 4.6
  Top Layer w0.305: U1.22 17.4,76.03 16.76,76.03 15.62,74.89 13.75,74.89 13.88,74.95 13.82,75.02 R3.1
PC14: length 3.9
  Top Layer w0.305: U1.23 16.26,73.62 16,73.36 R2.1
PC15: length 3.9
  Top Layer w0.305: U1.24 16.13,71.08 15.75,71.46 R1.1
PWMB: length 8.8
  Top Layer w0.305: U2.10 P7.5
RESET: length 48.3
  Top Layer w0.305: v1(15.24,38.57) 15.75,38.06 U1.37
  Bottom Layer w0.305: v1(15.24,38.57) 15.24,76.41 14.61,77.05 9.53,77.05 9.02,77.56 P6.2
USART2_RX: length 69.6
  Top Layer w0.254: U1.28 16.46,61.98 10.4,61.98 8.03,59.61 8.03,18.1 8.64,17.49 12.7,17.49 13.08,17.11 13.08,7.71 12.45,7.07 U9.5
USART2_TX: length 69.6
  Top Layer w0.254: U1.27 16.46,62.39 10.24,62.39 7.62,59.78 7.62,18.25 7.44,18.07 7.11,18.07 6.93,18.25 6.93,19.92 6.75,20.1 6.48,20.1 6.22,19.84 6.22,17.99 6.04,17.81 5.79,17.81 5.61,17.99 5.61,19.9 5.36,20.15 5.13,20.15 4.95,19.97 4.95,17.69 5.41,17.23 6.6,17.23 7.11,16.72 7.11,15.33 7.75,14.69 U9.1
$1N12480: length 2.2
  Top Layer w0.305: LED1.2 R1.2
$1N12483: length 2.2
  Top Layer w0.305: LED2.2 R2.2
$1N12485: length 2.2
  Top Layer w0.305: LED3.2 R3.2
$1N20799: length 2.8
  Top Layer w0.381: LED4.2 R4.2

## Copper pours and planes (outline as drawn; the poured copper is in the pictures)
3V3 on Top Layer: 34.54,20.53 34.54,21.17 34.93,21.55 37.08,21.55 37.21,21.42 37.21,19.57 36.9,19.26 34.93,19.26 34.93,18.14 33.9,17.12 30.34,17.12 29.28,18.25 29.28,20.12 29.3,20.12 29.58,20.41 34.42,20.41
+5V on Top Layer: 9.65,26.25 9.65,28.66 9.78,28.79 12.7,28.79 14.86,26.63 36.33,26.63 38.62,24.34 38.62,22.32 38.1,21.8 34.29,21.8 33.53,22.56 29.51,22.56 27.47,20.53 23.24,20.53 22.22,21.55 22.22,22.18 21.34,23.07 14.48,23.07 13.59,23.96 13.59,25.48 13.3,25.77 10.11,25.77
GND on Top Layer: -16.89,87.21 94.23,87.21 94.23,-1.19 -16.89,-1.19
GND on Bottom Layer: -8.64,85.56 88.01,85.56 88.01,-8.42 -8.64,-8.42

Small or netless copper shapes (teardrops, artwork), in the pictures only: 195 on Top Layer, 44 on Bottom Layer

## Text on the board
Top Silkscreen Layer: +5V | GND | AO | RESET | TX | - | 3.3V | + | RX | PA7 | PA8 | PA15 | PA6 | VBAT | PB10 | PB11 | PA4 | PA0 | 3V3 | PA5 | PB0 | PA1 | PB1 | PC13 | PC14 | PC15 | STM32F103C8T6 | BO2 | BO1 | PA12 | PA10 | PB14 | PB15 | PB13 | PB12 | PA11 | PB4 | PA9 | PB8 | PB5 | PB3 | PB9 | 5V | AO2 | AO1 | SDA | SCL | PWMA | PWMB | AIN2 | BIN2 | AIN1 | BIN1
